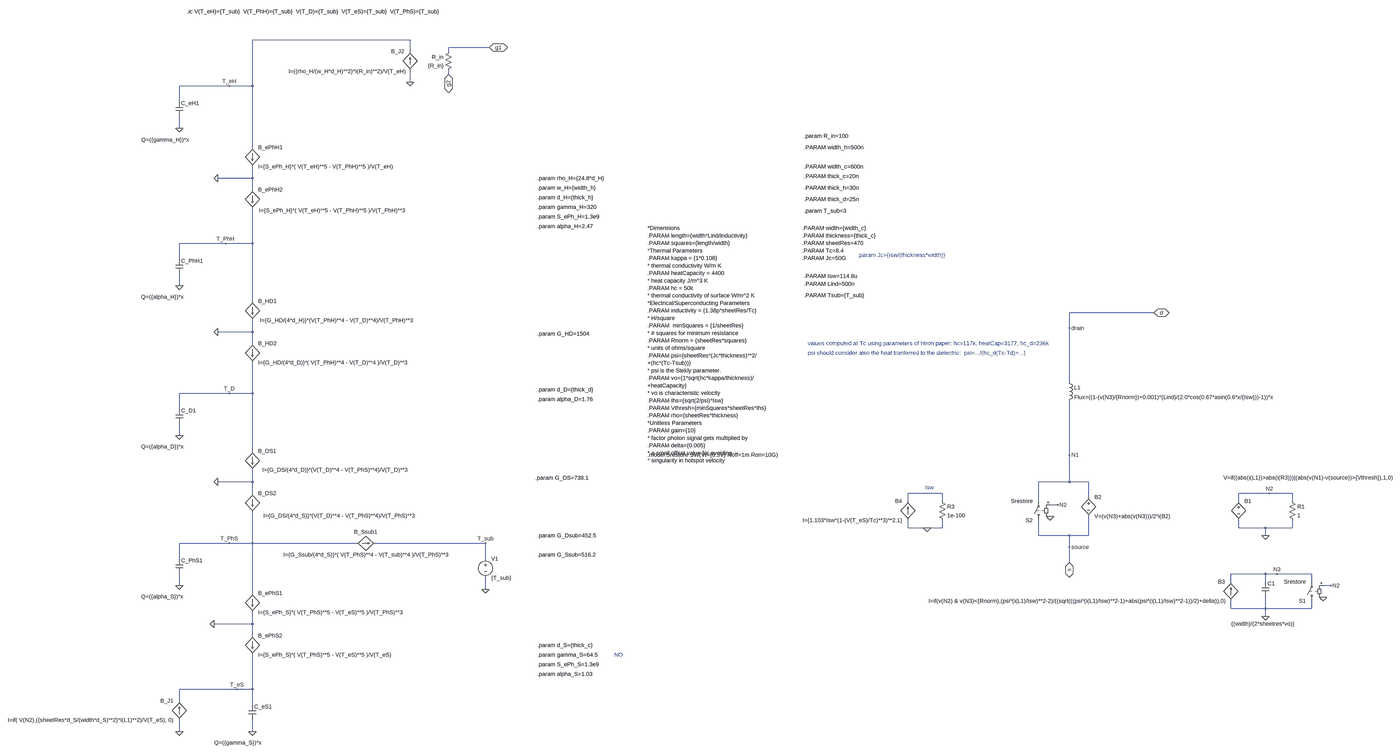
[diagram p0: schematic hTron_debug.asc, whole sheet]
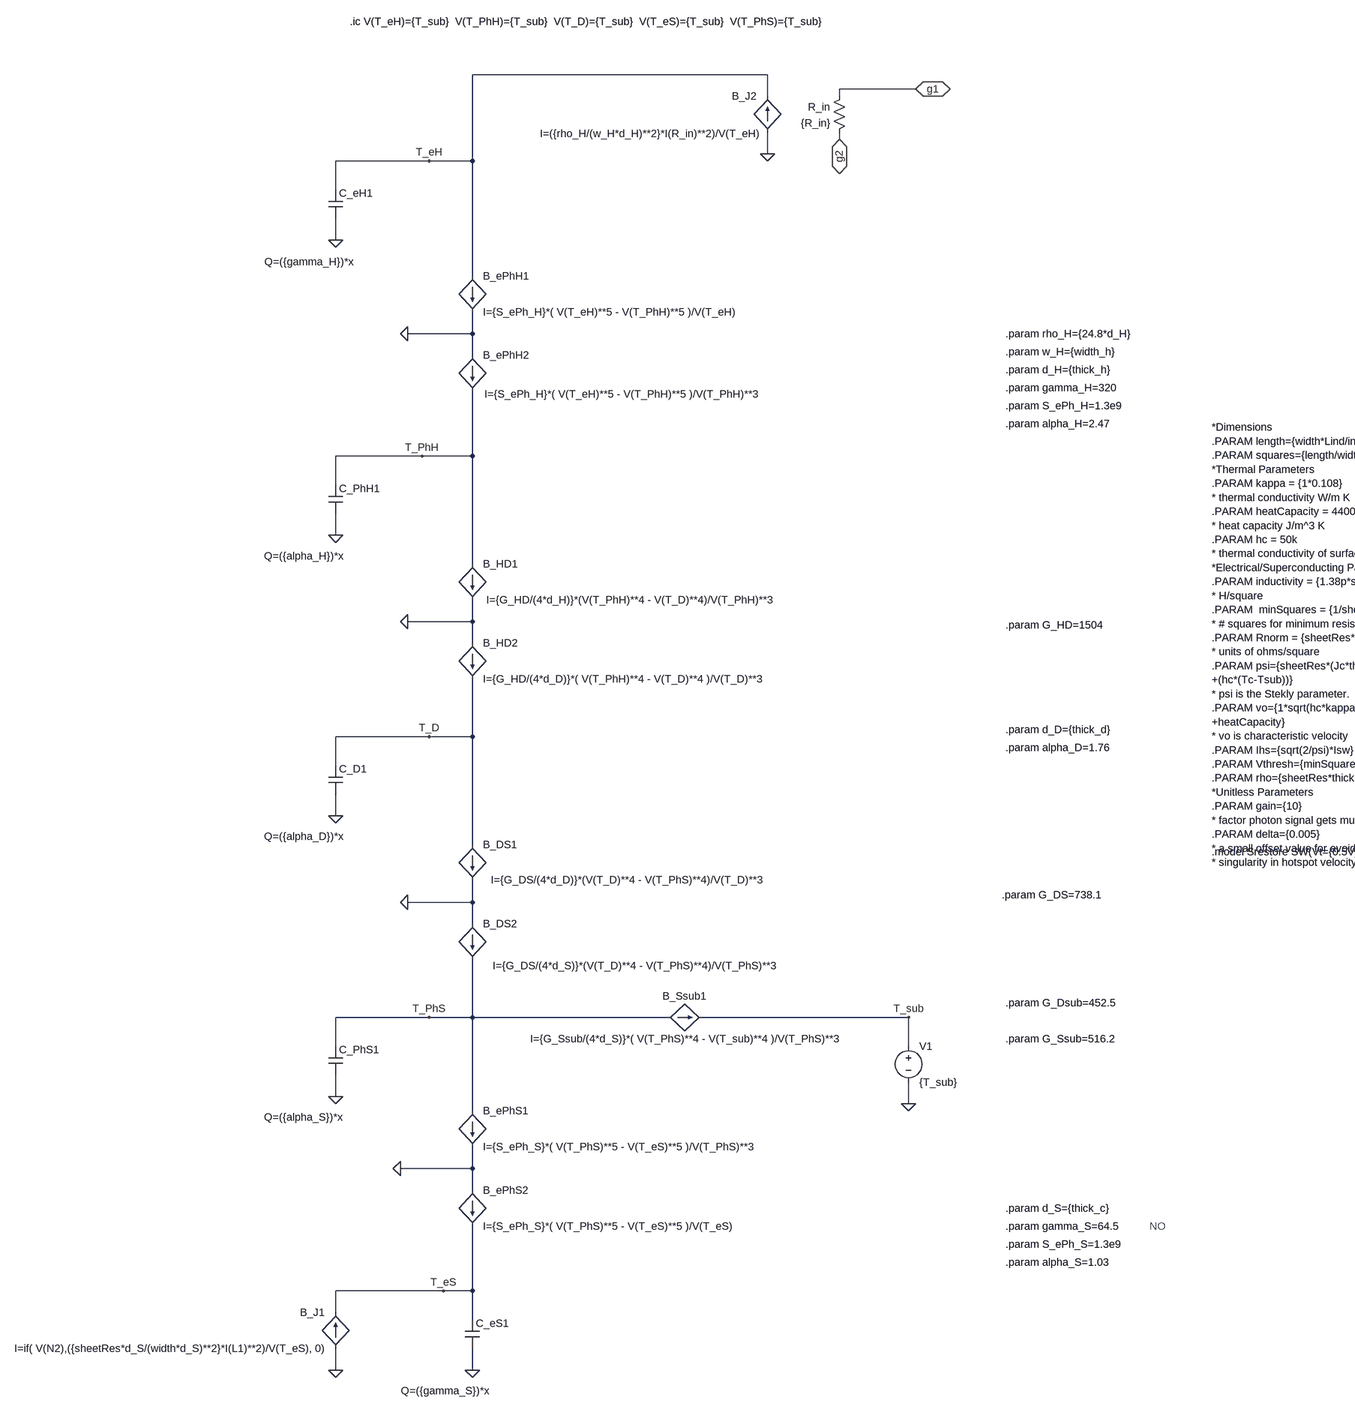
[diagram p1: schematic hTron_debug.asc, part, row 1 of 1, column 1 of 2]
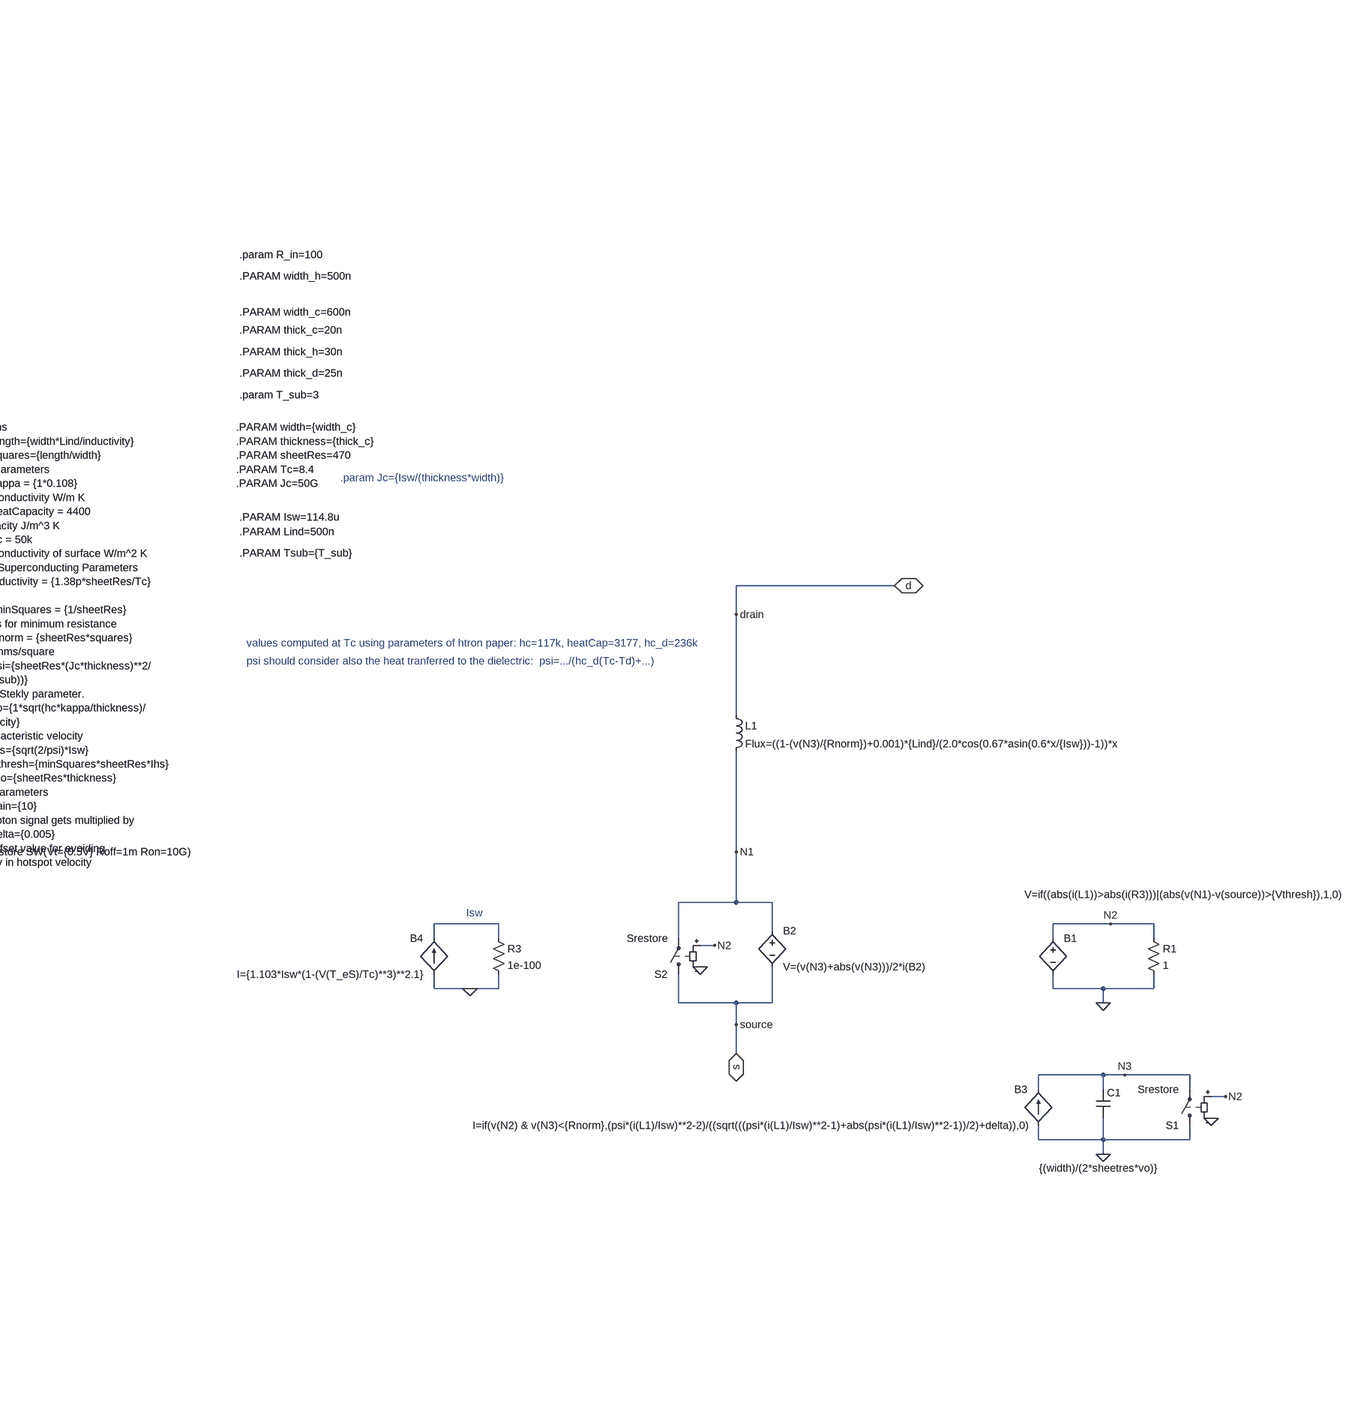
[diagram p2: schematic hTron_debug.asc, part, row 1 of 1, column 2 of 2]
hTron_debug.asc, the LTspice schematic file:
Version 4
SHEET 1 1872 1088
WIRE -3200 -1856 -3856 -1856
WIRE -2832 -1824 -3040 -1824
WIRE -3200 -1808 -3200 -1856
WIRE -3040 -1808 -3040 -1824
WIRE -3040 -1712 -3040 -1728
WIRE -3200 -1680 -3200 -1728
WIRE -3952 -1664 -4160 -1664
WIRE -3856 -1664 -3856 -1856
WIRE -3856 -1664 -3952 -1664
WIRE -4160 -1600 -4160 -1664
WIRE -4160 -1488 -4160 -1536
WIRE -3856 -1408 -3856 -1664
WIRE -3856 -1280 -3856 -1328
WIRE -3856 -1280 -4000 -1280
WIRE -3856 -1232 -3856 -1280
WIRE -3968 -1008 -4160 -1008
WIRE -3856 -1008 -3856 -1152
WIRE -3856 -1008 -3968 -1008
WIRE -4160 -944 -4160 -1008
WIRE -4160 -832 -4160 -880
WIRE -3856 -768 -3856 -1008
WIRE 208 -720 -144 -720
WIRE -144 -656 -144 -720
WIRE -3856 -640 -3856 -688
WIRE -3856 -640 -4000 -640
WIRE -3856 -592 -3856 -640
WIRE -144 -432 -144 -656
WIRE -3952 -384 -4160 -384
WIRE -3856 -384 -3856 -512
WIRE -3856 -384 -3952 -384
WIRE -4160 -320 -4160 -384
WIRE -4160 -208 -4160 -256
WIRE -3856 -144 -3856 -384
WIRE -144 -128 -144 -352
WIRE -3856 -16 -3856 -64
WIRE -3856 -16 -4000 -16
WIRE -144 -16 -144 -128
WIRE -144 -16 -272 -16
WIRE -64 -16 -144 -16
WIRE -3856 32 -3856 -16
WIRE -672 32 -816 32
WIRE 688 32 560 32
WIRE 784 32 688 32
WIRE -64 48 -64 -16
WIRE -816 64 -816 32
WIRE -672 64 -672 32
WIRE -272 64 -272 -16
WIRE 560 64 560 32
WIRE 784 64 784 32
WIRE -192 80 -224 80
WIRE -816 176 -816 144
WIRE -736 176 -816 176
WIRE -672 176 -672 144
WIRE -672 176 -736 176
WIRE 560 176 560 144
WIRE 672 176 560 176
WIRE 784 176 784 144
WIRE 784 176 672 176
WIRE -272 208 -272 144
WIRE -144 208 -272 208
WIRE -64 208 -64 128
WIRE -64 208 -144 208
WIRE 672 208 672 176
WIRE -3952 240 -4160 240
WIRE -3856 240 -3856 112
WIRE -3856 240 -3952 240
WIRE -3424 240 -3856 240
WIRE -2848 240 -3344 240
WIRE -144 256 -144 208
WIRE -4160 304 -4160 240
WIRE -2848 304 -2848 240
WIRE -144 320 -144 256
WIRE 672 368 528 368
WIRE 720 368 672 368
WIRE 864 368 720 368
WIRE 528 400 528 368
WIRE 672 400 672 368
WIRE 864 400 864 368
WIRE -4160 416 -4160 368
WIRE 944 416 912 416
WIRE -2848 432 -2848 384
WIRE -3856 448 -3856 240
WIRE 528 512 528 480
WIRE 672 512 672 464
WIRE 672 512 528 512
WIRE 864 512 864 480
WIRE 864 512 672 512
WIRE 672 544 672 512
WIRE -3856 576 -3856 528
WIRE -3856 576 -4016 576
WIRE -3856 624 -3856 576
WIRE -3920 848 -4160 848
WIRE -3856 848 -3856 704
WIRE -3856 848 -3920 848
WIRE -4160 896 -4160 848
WIRE -3856 912 -3856 848
WIRE -4160 1024 -4160 976
WIRE -3856 1024 -3856 976
FLAG -144 -656 drain
FLAG -144 -128 N1
FLAG 672 208 0
FLAG 688 32 N2
FLAG 672 544 0
FLAG 912 464 0
FLAG 944 416 N2
FLAG 720 368 N3
FLAG -144 256 source
FLAG -736 176 0
FLAG -224 128 0
FLAG -192 80 N2
FLAG -4160 1024 0
FLAG -3952 -1664 T_eH
FLAG -3200 -1680 0
FLAG -4160 -1488 0
FLAG -4000 -1280 0
FLAG -4160 -832 0
FLAG -3968 -1008 T_PhH
FLAG -4000 -640 0
FLAG -4160 -208 0
FLAG -3952 -384 T_D
FLAG -4000 -16 0
FLAG -4160 416 0
FLAG -3952 240 T_PhS
FLAG -2848 432 0
FLAG -2848 240 T_sub
FLAG -4016 576 0
FLAG -3856 1024 0
FLAG -3920 848 T_eS
FLAG -144 320 s
IOPIN -144 320 BiDir
FLAG 208 -720 d
IOPIN 208 -720 BiDir
FLAG -2832 -1824 g1
IOPIN -2832 -1824 BiDir
FLAG -3040 -1712 g2
IOPIN -3040 -1712 BiDir
SYMBOL ind -160 -448 R0
SYMATTR InstName L1
SYMATTR Value Flux=((1-(v(N3)/{Rnorm})+0.001)*{Lind}/(2.0*cos(0.67*asin(0.6*x/{Isw}))-1))*x
SYMATTR SpiceLine Rser=1e-100
SYMBOL bv -64 32 R0
SYMATTR InstName B2
SYMATTR Value V=(v(N3)+abs(v(N3)))/2*i(B2)
SYMBOL res 768 48 R0
SYMATTR InstName R1
SYMATTR Value 1
SYMBOL bv 560 48 R0
WINDOW 3 -63 -81 Left 2
SYMATTR Value V=if((abs(i(L1))>abs(i(R3)))|(abs(v(N1)-v(source))>{Vthresh}),1,0)
SYMATTR InstName B1
SYMBOL bi 528 480 R180
WINDOW 0 24 80 Left 2
WINDOW 3 24 0 Left 2
SYMATTR InstName B3
SYMATTR Value I=if(v(N2) & v(N3)<{Rnorm},(psi*(i(L1)/Isw)**2-2)/((sqrt(((psi*(i(L1)/Isw)**2-1)+abs(psi*(i(L1)/Isw)**2-1))/2)+delta)),0)
SYMBOL cap 656 400 R0
WINDOW 3 -127 175 Left 2
SYMATTR Value {(width)/(2*sheetres*vo)}
SYMATTR InstName C1
SYMBOL sw 864 496 R180
SYMATTR InstName S1
SYMATTR Value Srestore
SYMATTR Value2 OFF
SYMBOL res -688 48 R0
SYMATTR InstName R3
SYMATTR Value 1e-100
SYMBOL bi -816 144 R180
WINDOW 0 24 80 Left 2
WINDOW 3 24 0 Left 2
SYMATTR InstName B4
SYMATTR Value I={1.103*Isw*(1-(V(T_eS)/Tc)**3)**2.1}
SYMBOL sw -272 160 R180
SYMATTR InstName S2
SYMATTR Value Srestore
SYMATTR Value2 OFF
SYMBOL bi -4160 976 R180
WINDOW 0 24 80 Left 2
WINDOW 3 24 0 Left 2
SYMATTR InstName B_J1
SYMATTR Value I=if( V(N2),({sheetRes*d_S/(width*d_S)**2}*I(L1)**2)/V(T_eS), 0)
SYMBOL res -3024 -1824 M0
SYMATTR InstName R_in
SYMATTR Value {R_in}
SYMBOL bi -3200 -1728 R180
WINDOW 0 24 80 Left 2
WINDOW 3 18 -3 Left 2
SYMATTR InstName B_J2
SYMATTR Value I=({rho_H/(w_H*d_H)**2}*I(R_in)**2)/V(T_eH)
SYMBOL cap -4176 -1600 R0
WINDOW 3 -142 160 Left 2
SYMATTR Value Q=({gamma_H})*x
SYMATTR InstName C_eH1
SYMBOL bi -3856 -1408 R0
SYMATTR InstName B_ePhH1
SYMATTR Value I={S_ePh_H}*( V(T_eH)**5 - V(T_PhH)**5 )/V(T_eH)
SYMBOL bi -3856 -1232 R0
WINDOW 3 27 86 Left 2
SYMATTR Value I={S_ePh_H}*( V(T_eH)**5 - V(T_PhH)**5 )/V(T_PhH)**3
SYMATTR InstName B_ePhH2
SYMBOL cap -4176 -944 R0
WINDOW 3 -143 158 Left 2
SYMATTR Value Q=({alpha_H})*x
SYMATTR InstName C_PhH1
SYMBOL bi -3856 -768 R0
WINDOW 3 31 80 Left 2
SYMATTR Value I={G_HD/(4*d_H)}*(V(T_PhH)**4 - V(T_D)**4)/V(T_PhH)**3
SYMATTR InstName B_HD1
SYMBOL bi -3856 -592 R0
SYMATTR InstName B_HD2
SYMATTR Value I={G_HD/(4*d_D)}*( V(T_PhH)**4 - V(T_D)**4 )/V(T_D)**3
SYMBOL cap -4176 -320 R0
WINDOW 3 -143 158 Left 2
SYMATTR Value Q=({alpha_D})*x
SYMATTR InstName C_D1
SYMBOL bi -3856 -144 R0
WINDOW 3 41 78 Left 2
SYMATTR Value I={G_DS/(4*d_D)}*(V(T_D)**4 - V(T_PhS)**4)/V(T_D)**3
SYMATTR InstName B_DS1
SYMBOL bi -3856 32 R0
WINDOW 3 45 93 Left 2
SYMATTR Value I={G_DS/(4*d_S)}*(V(T_D)**4 - V(T_PhS)**4)/V(T_PhS)**3
SYMATTR InstName B_DS2
SYMBOL cap -4176 304 R0
WINDOW 3 -143 158 Left 2
SYMATTR Value Q=({alpha_S})*x
SYMATTR InstName C_PhS1
SYMBOL bi -3424 240 R270
WINDOW 0 32 40 VTop 2
WINDOW 3 -32 40 VBottom 2
SYMATTR InstName B_Ssub1
SYMATTR Value I={G_Ssub/(4*d_S)}*( V(T_PhS)**4 - V(T_sub)**4 )/V(T_PhS)**3
SYMBOL voltage -2848 288 R0
WINDOW 123 0 0 Left 0
WINDOW 39 0 0 Left 0
SYMATTR InstName V1
SYMATTR Value {T_sub}
SYMBOL bi -3856 448 R0
SYMATTR InstName B_ePhS1
SYMATTR Value I={S_ePh_S}*( V(T_PhS)**5 - V(T_eS)**5 )/V(T_PhS)**3
SYMBOL bi -3856 624 R0
SYMATTR InstName B_ePhS2
SYMATTR Value I={S_ePh_S}*( V(T_PhS)**5 - V(T_eS)**5 )/V(T_eS)
SYMBOL cap -3872 912 R0
WINDOW 3 -143 158 Left 2
SYMATTR Value Q=({gamma_S})*x
SYMATTR InstName C_eS1
TEXT -2536 -1160 Left 2 !.param gamma_H=320
TEXT -2536 -1120 Left 2 !.param S_ePh_H=1.3e9
TEXT -2536 -1280 Left 2 !.param rho_H={24.8*d_H}
TEXT -2536 -1240 Left 2 !.param w_H={width_h}
TEXT -2536 -1200 Left 2 !.param d_H={thick_h}
TEXT -2536 -1080 Left 2 !.param alpha_H=2.47
TEXT -2536 -632 Left 2 !.param G_HD=1504
TEXT -2536 -360 Left 2 !.param alpha_D=1.76
TEXT -2544 -32 Left 2 !.param G_DS=738.1
TEXT -2536 704 Left 2 !.param gamma_S=64.5
TEXT -2536 744 Left 2 !.param S_ePh_S=1.3e9
TEXT -2536 784 Left 2 !.param alpha_S=1.03
TEXT -2536 288 Left 2 !.param G_Ssub=516.2
TEXT -2536 664 Left 2 !.param d_S={thick_c}
TEXT -1248 -1144 Left 2 !.param T_sub=3
TEXT -2536 -400 Left 2 !.param d_D={thick_d}
TEXT -2216 704 Left 2 ;NO
TEXT -1912 -128 Left 2 !.model Srestore SW(Vt={0.5V} Roff=1m Ron=10G)
TEXT -1256 -1072 Left 2 !.PARAM width={width_c}\n.PARAM thickness={thick_c}\n.PARAM sheetRes=470\n.PARAM Tc=8.4\n.PARAM Jc=50G
TEXT -1248 -872 Left 2 !.PARAM Isw=114.8u
TEXT -1248 -840 Left 2 !.PARAM Lind=500n
TEXT -1912 -1072 Left 2 !*Dimensions\n.PARAM length={width*Lind/inductivity}\n.PARAM squares={length/width}\n*Thermal Parameters\n.PARAM kappa = {1*0.108}\n* thermal conductivity W/m K\n.PARAM heatCapacity = 4400\n* heat capacity J/m^3 K\n.PARAM hc = 50k\n* thermal conductivity of surface W/m^2 K\n*Electrical/Superconducting Parameters\n.PARAM inductivity = {1.38p*sheetRes/Tc}\n* H/square\n.PARAM  minSquares = {1/sheetRes}\n* # squares for minimum resistance\n.PARAM Rnorm = {sheetRes*squares}\n* units of ohms/square\n.PARAM psi={sheetRes*(Jc*thickness)**2/\n+(hc*(Tc-Tsub))}\n* psi is the Stekly parameter.\n.PARAM vo={1*sqrt(hc*kappa/thickness)/\n+heatCapacity}\n* vo is characteristic velocity\n.PARAM Ihs={sqrt(2/psi)*Isw}\n.PARAM Vthresh={minSquares*sheetRes*Ihs}\n.PARAM rho={sheetRes*thickness}\n*Unitless Parameters\n.PARAM gain={10}\n* factor photon signal gets multiplied by\n.PARAM delta={0.005}\n* a small offset value for avoiding\n* singularity in hotspot velocity
TEXT -744 8 Left 2 ;Isw
TEXT -1248 -792 Left 2 !.PARAM Tsub={T_sub}
TEXT -2536 208 Left 2 !.param G_Dsub=452.5
TEXT -4128 -2016 Left 2 !.ic V(T_eH)={T_sub}  V(T_PhH)={T_sub}  V(T_D)={T_sub}  V(T_eS)={T_sub}  V(T_PhS)={T_sub}
TEXT -1248 -1456 Left 2 !.param R_in=100
TEXT -1232 -592 Left 2 ;values computed at Tc using parameters of htron paper: hc=117k, heatCap=3177, hc_d=236k
TEXT -1024 -960 Left 2 ;.param Jc={Isw/(thickness*width)}
TEXT -1248 -1328 Left 2 !.PARAM width_c=600n
TEXT -1248 -1408 Left 2 !.PARAM width_h=500n
TEXT -1248 -1288 Left 2 !.PARAM thick_c=20n
TEXT -1248 -1240 Left 2 !.PARAM thick_h=30n
TEXT -1248 -1192 Left 2 !.PARAM thick_d=25n
TEXT -1232 -552 Left 2 ;psi should consider also the heat tranferred to the dielectric:  psi=.../(hc_d(Tc-Td)+...)

The netlist it stands for:
* hTron_debug.asc
L1 d N1 Flux=((1-(v(N3)/{Rnorm})+0.001)*{Lind}/(2.0*cos(0.67*asin(0.6*x/{Isw}))-1))*x Rser=1e-100
B2 N1 s V=(v(N3)+abs(v(N3)))/2*i(B2)
R1 N2 0 1
B1 N2 0 V=if((abs(i(L1))>abs(i(R3)))|(abs(v(N1)-v(source))>{Vthresh}),1,0)
B3 0 N3 I=if(v(N2) & v(N3)<{Rnorm},(psi*(i(L1)/Isw)**2-2)/((sqrt(((psi*(i(L1)/Isw)**2-1)+abs(psi*(i(L1)/Isw)**2-1))/2)+delta)),0)
C1 N3 0 {(width)/(2*sheetres*vo)}
S1 0 N3 N2 0 Srestore OFF
R3 N001 0 1e-100
B4 0 N001 I={1.103*Isw*(1-(V(T_eS)/Tc)**3)**2.1}
S2 s N1 N2 0 Srestore OFF
B_J1 0 T_eS I=if( V(N2),({sheetRes*d_S/(width*d_S)**2}*I(L1)**2)/V(T_eS), 0)
R_in g1 g2 {R_in}
B_J2 0 T_eH I=({rho_H/(w_H*d_H)**2}*I(R_in)**2)/V(T_eH)
C_eH1 T_eH 0 Q=({gamma_H})*x
B_ePhH1 T_eH 0 I={S_ePh_H}*( V(T_eH)**5 - V(T_PhH)**5 )/V(T_eH)
B_ePhH2 0 T_PhH I={S_ePh_H}*( V(T_eH)**5 - V(T_PhH)**5 )/V(T_PhH)**3
C_PhH1 T_PhH 0 Q=({alpha_H})*x
B_HD1 T_PhH 0 I={G_HD/(4*d_H)}*(V(T_PhH)**4 - V(T_D)**4)/V(T_PhH)**3
B_HD2 0 T_D I={G_HD/(4*d_D)}*( V(T_PhH)**4 - V(T_D)**4 )/V(T_D)**3
C_D1 T_D 0 Q=({alpha_D})*x
B_DS1 T_D 0 I={G_DS/(4*d_D)}*(V(T_D)**4 - V(T_PhS)**4)/V(T_D)**3
B_DS2 0 T_PhS I={G_DS/(4*d_S)}*(V(T_D)**4 - V(T_PhS)**4)/V(T_PhS)**3
C_PhS1 T_PhS 0 Q=({alpha_S})*x
B_Ssub1 T_PhS T_sub I={G_Ssub/(4*d_S)}*( V(T_PhS)**4 - V(T_sub)**4 )/V(T_PhS)**3
V1 T_sub 0 {T_sub}
B_ePhS1 T_PhS 0 I={S_ePh_S}*( V(T_PhS)**5 - V(T_eS)**5 )/V(T_PhS)**3
B_ePhS2 0 T_eS I={S_ePh_S}*( V(T_PhS)**5 - V(T_eS)**5 )/V(T_eS)
C_eS1 T_eS 0 Q=({gamma_S})*x
.param gamma_H=320
.param S_ePh_H=1.3e9
.param rho_H={24.8*d_H}
.param w_H={width_h}
.param d_H={thick_h}
.param alpha_H=2.47
.param G_HD=1504
.param alpha_D=1.76
.param G_DS=738.1
.param gamma_S=64.5
.param S_ePh_S=1.3e9
.param alpha_S=1.03
.param G_Ssub=516.2
.param d_S={thick_c}
.param T_sub=3
.param d_D={thick_d}
* NO
.model Srestore SW(Vt={0.5V} Roff=1m Ron=10G)
.PARAM width={width_c}
.PARAM thickness={thick_c}
.PARAM sheetRes=470
.PARAM Tc=8.4
.PARAM Jc=50G
.PARAM Isw=114.8u
.PARAM Lind=500n
*Dimensions
.PARAM length={width*Lind/inductivity}
.PARAM squares={length/width}
*Thermal Parameters
.PARAM kappa = {1*0.108}
* thermal conductivity W/m K
.PARAM heatCapacity = 4400
* heat capacity J/m^3 K
.PARAM hc = 50k
* thermal conductivity of surface W/m^2 K
*Electrical/Superconducting Parameters
.PARAM inductivity = {1.38p*sheetRes/Tc}
* H/square
.PARAM  minSquares = {1/sheetRes}
* # squares for minimum resistance
.PARAM Rnorm = {sheetRes*squares}
* units of ohms/square
.PARAM psi={sheetRes*(Jc*thickness)**2/
+(hc*(Tc-Tsub))}
* psi is the Stekly parameter.
.PARAM vo={1*sqrt(hc*kappa/thickness)/
+heatCapacity}
* vo is characteristic velocity
.PARAM Ihs={sqrt(2/psi)*Isw}
.PARAM Vthresh={minSquares*sheetRes*Ihs}
.PARAM rho={sheetRes*thickness}
*Unitless Parameters
.PARAM gain={10}
* factor photon signal gets multiplied by
.PARAM delta={0.005}
* a small offset value for avoiding
* singularity in hotspot velocity
* Isw
.PARAM Tsub={T_sub}
.param G_Dsub=452.5
.ic V(T_eH)={T_sub}  V(T_PhH)={T_sub}  V(T_D)={T_sub}  V(T_eS)={T_sub}  V(T_PhS)={T_sub}
.param R_in=100
* values computed at Tc using parameters of htron paper: hc=117k, heatCap=3177, hc_d=236k
* .param Jc={Isw/(thickness*width)}
.PARAM width_c=600n
.PARAM width_h=500n
.PARAM thick_c=20n
.PARAM thick_h=30n
.PARAM thick_d=25n
* psi should consider also the heat tranferred to the dielectric:  psi=.../(hc_d(Tc-Td)+...)
.backanno
.end